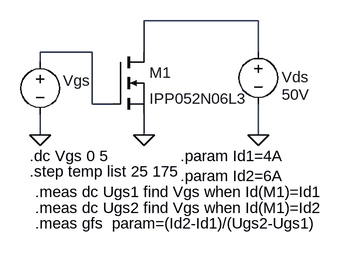
[diagram p0: schematic trans-1-1-1.asc]
trans-1-1-1.asc, the LTspice schematic file:
Version 4
SHEET 1 1292 680
WIRE -544 -176 -720 -176
WIRE -800 -128 -880 -128
WIRE -720 -128 -720 -176
WIRE -544 -128 -544 -176
WIRE -880 -112 -880 -128
WIRE -800 -48 -800 -128
WIRE -768 -48 -800 -48
WIRE -880 0 -880 -32
WIRE -720 0 -720 -32
WIRE -544 0 -544 -48
FLAG -544 0 0
FLAG -880 0 0
FLAG -720 0 0
SYMBOL voltage -544 -144 R0
WINDOW 123 0 0 Left 2
WINDOW 0 36 55 Left 2
WINDOW 3 36 82 Left 2
SYMATTR InstName Vds
SYMATTR Value 50V
SYMBOL voltage -880 -128 R0
WINDOW 123 0 0 Left 2
WINDOW 39 40 53 Left 2
WINDOW 3 -97 181 Left 2
WINDOW 0 35 44 Left 2
SYMATTR Value ""
SYMATTR InstName Vgs
SYMBOL nmos -768 -128 R0
SYMATTR InstName M1
SYMATTR Value IPP052N06L3
TEXT -896 32 Left 2 !.dc Vgs 0 5
TEXT -896 56 Left 2 !.step temp list 25 175
TEXT -888 88 Left 2 !.meas dc Ugs1 find Vgs when Id(M1)=Id1
TEXT -888 112 Left 2 !.meas dc Ugs2 find Vgs when Id(M1)=Id2
TEXT -888 136 Left 2 !.meas gfs  param=(Id2-Id1)/(Ugs2-Ugs1)
TEXT -664 32 Left 2 !.param Id1=4A\n.param Id2=6A

The netlist it stands for:
* trans-1-1-1.asc
Vds N001 0 50V
Vgs N002 0
M1 N001 N002 0 0 IPP052N06L3
.model NMOS NMOS
.model PMOS PMOS
.lib standard.mos
.dc Vgs 0 5
.step temp list 25 175
.meas dc Ugs1 find Vgs when Id(M1)=Id1
.meas dc Ugs2 find Vgs when Id(M1)=Id2
.meas gfs  param=(Id2-Id1)/(Ugs2-Ugs1)
.param Id1=4A
.param Id2=6A
.backanno
.end